# Altium project Interface Panel(State Board).PrjPcb
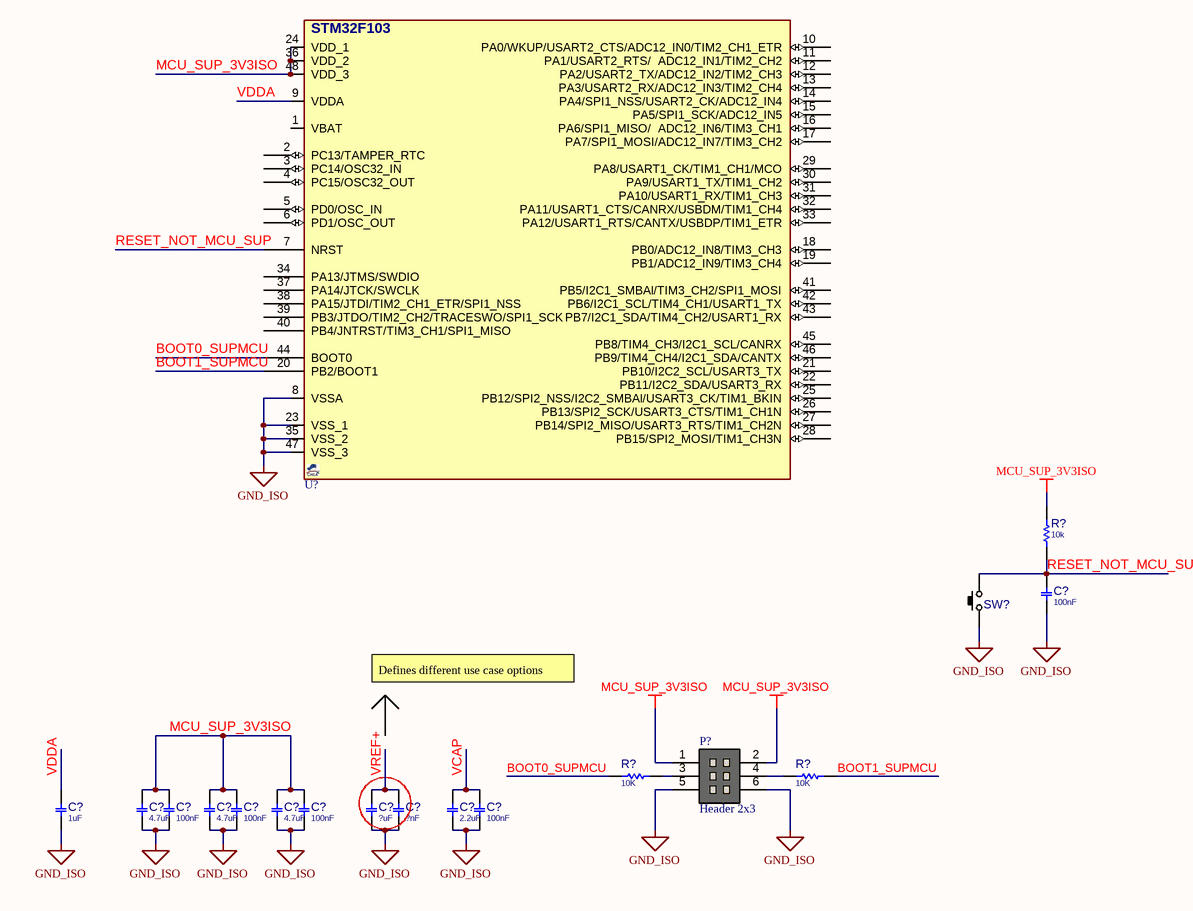
[diagram p0: MCU Sup.SchDoc]
3 sheets, 51 parts. Net scope: global (net labels, ports and power ports of the same name join across sheets).
Sheets:
  MCU Sup.SchDoc
  States LED.SchDoc
  On Board Terminals.SchDoc

## Sheet MCU Sup.SchDoc
size 297 x 209 mm; SheetNumber: 1; SheetTotal: 3

### Parts
(Parts that share a designator on the sheet are numbered #1, #2 ... from top to bottom, then left to right.)
C?#1  100nF  [C0603]
C?#2  1uF  [C0805]
C?#3  4.7uF  [C0805]
C?#4  100nF  [C0603]
C?#5  4.7uF  [C0805]
C?#6  100nF  [C0603]
C?#7  4.7uF  [C0805]
C?#8  100nF  [C0805]
C?#9  ?uF  [C0805]
C?#10  ?nF  [C0603]
C?#11  2.2uF  [C0805]
C?#12  100nF  [C0603]
P?  Header 2x3  [HDR 2X3]
R?#1  10k  [R0603]
R?#2  10K  [R0603]
R?#3  10K  [R0603]
SW?  PUSHBUTTON  [SWPBS_SPST_6X3X5]  (value not drawn)
U?  STM32F103  [QFG50_48]  (value not drawn)

### Nets
GND_ISO: C?#1.2 C?#2.2 C?#3.2 C?#4.2 C?#5.2 C?#6.2 C?#7.2 C?#8.2 C?#9.2 C?#10.2 C?#11.2 C?#12.2 P?.5 P?.6 SW?.1(P1) U?.8(VSSA) U?.23(VSS_1) U?.35(VSS_2) U?.47(VSS_3)
MCU_SUP_3V3ISO: C?#3.1 C?#4.1 C?#5.1 C?#6.1 C?#7.1 C?#8.1 P?.1 P?.2 R?#1.2 U?.24(VDD_1) U?.36(VDD_2) U?.48(VDD_3)
BOOT0_SUPMCU: R?#2.1 U?.44(BOOT0)
BOOT1_SUPMCU: R?#3.2 U?.20(PB2/BOOT1)
RESET_NOT_MCU_SUP: C?#1.1 R?#1.1 SW?.2(P3) U?.7(NRST)
VCAP: C?#11.1 C?#12.1
VDDA: C?#2.1 U?.9(VDDA)
VREF+: C?#9.1 C?#10.1
NetP?_3: P?.3 R?#2.2
NetP?_4: P?.4 R?#3.1

Not connected (* = marked no-connect by the designer): U? 1(VBAT) 2(PC13/TAMPER_RTC) 3(PC14/OSC32_IN) 4(PC15/OSC32_OUT) 5(PD0/OSC_IN) 6(PD1/OSC_OUT) 10(PA0/WKUP/USART2_CTS/ADC12_IN0/TIM2_CH1_ETR) 11(PA1/USART2_RTS/__ADC12_IN1/TIM2_CH2) 12(PA2/USART2_TX/ADC12_IN2/TIM2_CH3) 13(PA3/USART2_RX/ADC12_IN3/TIM2_CH4) 14(PA4/SPI1_NSS/USART2_CK/ADC12_IN4) 15(PA5/SPI1_SCK/ADC12_IN5) 16(PA6/SPI1_MISO/__ADC12_IN6/TIM3_CH1) 17(PA7/SPI1_MOSI/ADC12_IN7/TIM3_CH2) 18(PB0/ADC12_IN8/TIM3_CH3) 19(PB1/ADC12_IN9/TIM3_CH4) 21(PB10/I2C2_SCL/USART3_TX) 22(PB11/I2C2_SDA/USART3_RX) 25(PB12/SPI2_NSS/I2C2_SMBAl/USART3_CK/TIM1_BKIN) 26(PB13/SPI2_SCK/USART3_CTS/TIM1_CH1N) 27(PB14/SPI2_MISO/USART3_RTS/TIM1_CH2N) 28(PB15/SPI2_MOSI/TIM1_CH3N) 29(PA8/USART1_CK/TIM1_CH1/MCO) 30(PA9/USART1_TX/TIM1_CH2) 31(PA10/USART1_RX/TIM1_CH3) 32(PA11/USART1_CTS/CANRX/USBDM/TIM1_CH4) 33(PA12/USART1_RTS/CANTX/USBDP/TIM1_ETR) 34(PA13/JTMS/SWDIO) 37(PA14/JTCK/SWCLK) 38(PA15/JTDI/TIM2_CH1_ETR/SPI1_NSS) 39(PB3/JTDO/TIM2_CH2/TRACESWO/SPI1_SCK) 40(PB4/JNTRST/TIM3_CH1/SPI1_MISO) 41(PB5/I2C1_SMBAl/TIM3_CH2/SPI1_MOSI) 42(PB6/I2C1_SCL/TIM4_CH1/USART1_TX) 43(PB7/I2C1_SDA/TIM4_CH2/USART1_RX) 45(PB8/TIM4_CH3/I2C1_SCL/CANRX) 46(PB9/TIM4_CH4/I2C1_SDA/CANTX)

### Notes on the sheet
- Defines different use case options
- Drawn
- Name
- Date
- Drawing Title
- Checked
- Drawing No.
- Approved
- Size
- A4
- Ver.
- Rev.
- Sheet
- Of

### Library data of the parts
C?#1 C?#4 C?#6 C?#10 C?#12 = CAP_SMD_MLCC_2.2u50V_0603: CAP, MLCC; MANF_P#: C1005X7R1H104K050BB; MANF: TDK; PARAM: X7R, 10%; DIST#: MOUSER; PARAM2: 50V; ASSEMBLY: ASSEMBLY; PRICE: 1000= 27$; DESC: CAP, MLCC
  C?#1 C?#4 C?#6 C?#12: VALUE: 100nF
  C?#10: VALUE: ?nF
C?#2 C?#3 C?#5 C?#7-C?#9 C?#11 = CAP_SMD_MLCC_2.2u50V_0805: CAP, MLCC; MANF_P#: UMK212ABJ225KG-T; MANF: Taiyo Yuden; PARAM: X5R, 10%; DIST#: MOUSER; PARAM2: 50V; ASSEMBLY: ASSEMBLY; PRICE: 100= 10$; DESC: CAP, MLCC
  C?#2: VALUE: 1uF
  C?#3 C?#5 C?#7: VALUE: 4.7uF
  C?#8: VALUE: 100nF
  C?#9: VALUE: ?uF
  C?#11: VALUE: 2.2uF
R?#1 = RES_SMD_0603: RESISTOR, SMD; PARAM: -W; DESC: DESCRIPTION; DIST#: MOUSER; PARAM2: 1%; MANF_P#: -; MANF: -; ASSEMBLY: ASSEMBLY; PRICE: 100= 0.5$; VALUE: 10k
R?#2 R?#3 = RES_SMD: RESISTOR, SMD; PARAM: -W; DESC: DESCRIPTION; DIST#: MOUSER; PARAM2: 1%; MANF_P#: -; MANF: -; ASSEMBLY: ASSEMBLY; PRICE: 100= 0.5$; VALUE: 10K
SW? = SWPBS_SPST_6X3X5: SWITCH, PUSH BUTTON, TACTILE, SMD, SPST, 6X3.5X5mm; MANF: ALPS; DESC: DESCRIPTION; MANF_P#: SKQMBBE010; VALUE: PUSHBUTTON; ASSEMBLY: ASSEMBLY; PARAM: PARAM; PRICE: PRICE
U? = STM32F103C8T6_QFP48: MCU, STM32 ARM 32-bit, Cortex M3, 64KB FLASH, 20KB SRAM; DESC: CAN, I2C, SPI, USART, USB; MANF: ST; PARAM2: 2~3.6VCC, 72MHz, 2X12Bit ADC; PARAM: 64KB FLASH, 20KB SRAM, -40~85oC; MANF_P#: STM32F103C8T6; PRICE: 6$; VALUE: STM32F103
P? = Header 2x3: ComponentLinkp-URL: https://www.smartw.ir/; DatasheetVersion: 2020

## Sheet States LED.SchDoc
size 297 x 209 mm; SheetNumber: 3; SheetTotal: 4
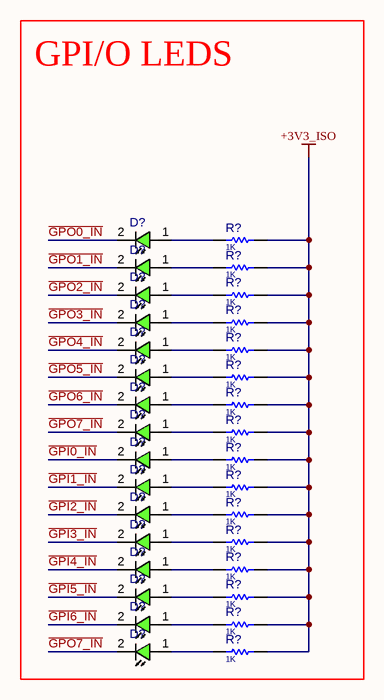
[diagram p1: States LED.SchDoc]

### Parts
(Parts that share a designator on the sheet are numbered #1, #2 ... from top to bottom, then left to right.)
D?#1  (no value)  [LED1206GRN]
D?#2  (no value)  [LED1206GRN]
D?#3  (no value)  [LED1206GRN]
D?#4  (no value)  [LED1206GRN]
D?#5  (no value)  [LED1206GRN]
D?#6  (no value)  [LED1206GRN]
D?#7  (no value)  [LED1206GRN]
D?#8  (no value)  [LED1206GRN]
D?#9  (no value)  [LED1206GRN]
D?#10  (no value)  [LED1206GRN]
D?#11  (no value)  [LED1206GRN]
D?#12  (no value)  [LED1206GRN]
D?#13  (no value)  [LED1206GRN]
D?#14  (no value)  [LED1206GRN]
D?#15  (no value)  [LED1206GRN]
D?#16  (no value)  [LED1206GRN]
R?#4  1K  [R1206]
R?#5  1K  [R1206]
R?#6  1K  [R1206]
R?#7  1K  [R1206]
R?#8  1K  [R1206]
R?#9  1K  [R1206]
R?#10  1K  [R1206]
R?#11  1K  [R1206]
R?#12  1K  [R1206]
R?#13  1K  [R1206]
R?#14  1K  [R1206]
R?#15  1K  [R1206]
R?#16  1K  [R1206]
R?#17  1K  [R1206]
R?#18  1K  [R1206]
R?#19  1K  [R1206]

### Blocks framed on the sheet
GPI/O LEDS: D?#1-D?#16 R?#4-R?#19

### Nets
+3V3_ISO: R?#4.2 R?#5.2 R?#6.2 R?#7.2 R?#8.2 R?#9.2 R?#10.2 R?#11.2 R?#12.2 R?#13.2 R?#14.2 R?#15.2 R?#16.2 R?#17.2 R?#18.2 R?#19.2
~{GPI0_IN}: D?#9.2(CATHODE)
~{GPI1_IN}: D?#10.2(CATHODE)
~{GPI2_IN}: D?#11.2(CATHODE)
~{GPI3_IN}: D?#12.2(CATHODE)
~{GPI4_IN}: D?#13.2(CATHODE)
~{GPI5_IN}: D?#14.2(CATHODE)
~{GPI6_IN}: D?#15.2(CATHODE)
~{GPO0_IN}: D?#1.2(CATHODE)
~{GPO1_IN}: D?#2.2(CATHODE)
~{GPO2_IN}: D?#3.2(CATHODE)
~{GPO3_IN}: D?#4.2(CATHODE)
~{GPO4_IN}: D?#5.2(CATHODE)
~{GPO5_IN}: D?#6.2(CATHODE)
~{GPO6_IN}: D?#7.2(CATHODE)
~{GPO7_IN}: D?#8.2(CATHODE) D?#16.2(CATHODE)
NetD?#1_1: D?#1.1(ANODE) R?#4.1
NetD?#2_1: D?#2.1(ANODE) R?#5.1
NetD?#3_1: D?#3.1(ANODE) R?#6.1
NetD?#4_1: D?#4.1(ANODE) R?#7.1
NetD?#5_1: D?#5.1(ANODE) R?#8.1
NetD?#6_1: D?#6.1(ANODE) R?#9.1
NetD?#7_1: D?#7.1(ANODE) R?#10.1
NetD?#8_1: D?#8.1(ANODE) R?#11.1
NetD?#9_1: D?#9.1(ANODE) R?#12.1
NetD?#10_1: D?#10.1(ANODE) R?#13.1
NetD?#11_1: D?#11.1(ANODE) R?#14.1
NetD?#12_1: D?#12.1(ANODE) R?#15.1
NetD?#13_1: D?#13.1(ANODE) R?#16.1
NetD?#14_1: D?#14.1(ANODE) R?#17.1
NetD?#15_1: D?#15.1(ANODE) R?#18.1
NetD?#16_1: D?#16.1(ANODE) R?#19.1

### Notes on the sheet
- Drawn
- Name
- Date
- Drawing Title
- Checked
- Drawing No.
- Approved
- Size
- A4
- Ver.
- Rev.
- Sheet
- Of

### Library data of the parts
D?#1-D?#16 = LED_SMD_1206_GRN: LED, SMD, 1206, GREEN; PARAM: 20mA; DESC: DESCRIPTION; PARAM2: 2.2V; MANF: -; ASSEMBLY: ASSEMBLY; PRICE: 36t@Javan; MANF_P#: -
R?#4-R?#19 = RES_SMD_1206: RESISTOR, SMD; PARAM: -W; DESC: DESCRIPTION; DIST#: MOUSER; PARAM2: 1%; MANF_P#: -; MANF: -; ASSEMBLY: ASSEMBLY; PRICE: 100= 0.5$; VALUE: 1K

## Sheet On Board Terminals.SchDoc
size 297 x 209 mm; SheetNumber: 4; SheetTotal: 4
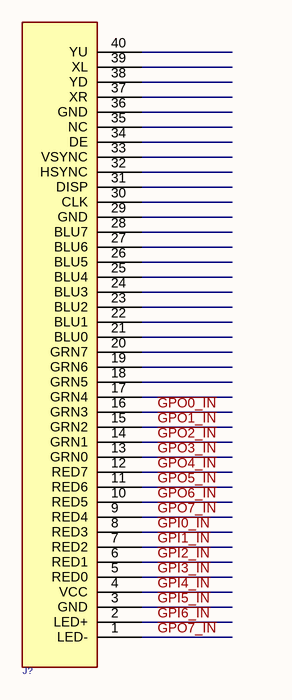
[diagram p2: On Board Terminals.SchDoc]

### Parts
J?  FPC50 40  [FPC50_40]  (value not drawn)

### Nets
~{GPI0_IN}: J?.8(RED3)
~{GPI1_IN}: J?.7(RED2)
~{GPI2_IN}: J?.6(RED1)
~{GPI3_IN}: J?.5(RED0)
~{GPI4_IN}: J?.4(VCC)
~{GPI5_IN}: J?.3(GND)
~{GPI6_IN}: J?.2(LED+)
~{GPO0_IN}: J?.16(GRN3)
~{GPO1_IN}: J?.15(GRN2)
~{GPO2_IN}: J?.14(GRN1)
~{GPO3_IN}: J?.13(GRN0)
~{GPO4_IN}: J?.12(RED7)
~{GPO5_IN}: J?.11(RED6)
~{GPO6_IN}: J?.10(RED5)
~{GPO7_IN}: J?.1(LED-) J?.9(RED4)

Not connected (* = marked no-connect by the designer): J? 17(GRN4) 18(GRN5) 19(GRN6) 20(GRN7) 21(BLU0) 22(BLU1) 23(BLU2) 24(BLU3) 25(BLU4) 26(BLU5) 27(BLU6) 28(BLU7) 29(GND) 30(CLK) 31(DISP) 32(HSYNC) 33(VSYNC) 34(DE) 35(NC) 36(GND) 37(XR) 38(YD) 39(XL) 40(YU)

### Notes on the sheet
- Drawn
- Name
- Date
- Drawing Title
- Checked
- Drawing No.
- Approved
- Size
- A4
- Ver.
- Rev.
- Sheet
- Of

### Library data of the parts
J? = FPC50 40: CONN, FPC, 0.50mm pitch, RightAngle, Bot. Contact; ComponentLink1Description: Website Smart World; ComponentLink1URL: https://www.smartw.ir/; ComponentLink2Description: Telegram; ComponentLink2URL: https://t.me/altium_smartw; ComponentLink3Description: Instagram; ComponentLink3URL: https://Instagram.com/smartgw.ir; DatasheetVersion: 2021

## Nets that join several sheets
~{GPI0_IN}: States LED (D?#9.2), On Board Terminals (J?.8)
~{GPI1_IN}: States LED (D?#10.2), On Board Terminals (J?.7)
~{GPI2_IN}: States LED (D?#11.2), On Board Terminals (J?.6)
~{GPI3_IN}: States LED (D?#12.2), On Board Terminals (J?.5)
~{GPI4_IN}: States LED (D?#13.2), On Board Terminals (J?.4)
~{GPI5_IN}: States LED (D?#14.2), On Board Terminals (J?.3)
~{GPI6_IN}: States LED (D?#15.2), On Board Terminals (J?.2)
~{GPO0_IN}: States LED (D?#1.2), On Board Terminals (J?.16)
~{GPO1_IN}: States LED (D?#2.2), On Board Terminals (J?.15)
~{GPO2_IN}: States LED (D?#3.2), On Board Terminals (J?.14)
~{GPO3_IN}: States LED (D?#4.2), On Board Terminals (J?.13)
~{GPO4_IN}: States LED (D?#5.2), On Board Terminals (J?.12)
~{GPO5_IN}: States LED (D?#6.2), On Board Terminals (J?.11)
~{GPO6_IN}: States LED (D?#7.2), On Board Terminals (J?.10)
~{GPO7_IN}: States LED (D?#8.2 D?#16.2), On Board Terminals (J?.1 J?.9)